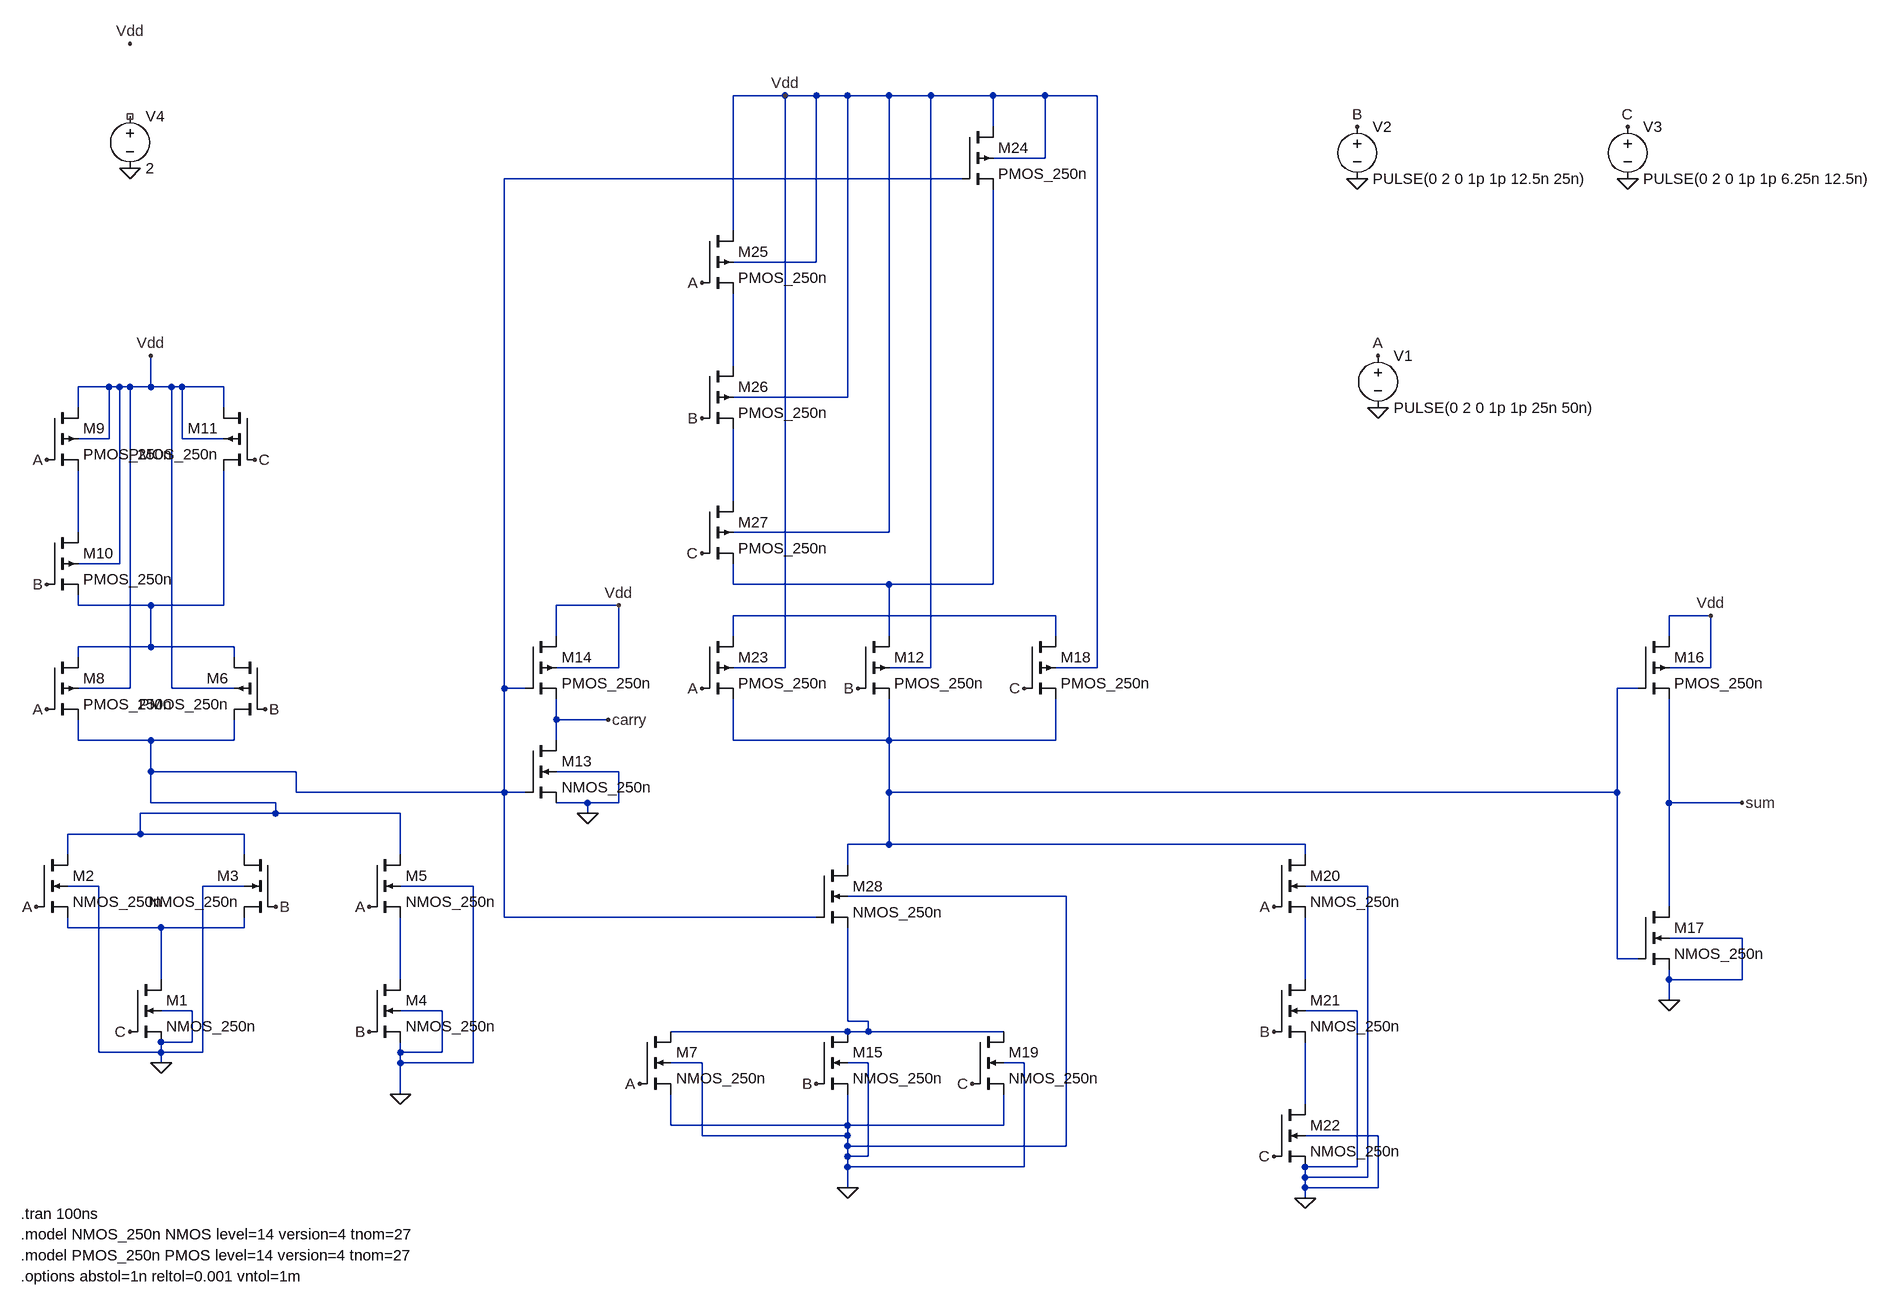
[diagram p0: schematic CMOS_Full_Adder.asc]
CMOS_Full_Adder.asc, the LTspice schematic file:
Version 4.1
SHEET 1 2684 760
WIRE 992 -1072 912 -1072
WIRE 1040 -1072 992 -1072
WIRE 1088 -1072 1040 -1072
WIRE 1152 -1072 1088 -1072
WIRE 1216 -1072 1152 -1072
WIRE 1312 -1072 1216 -1072
WIRE 1392 -1072 1312 -1072
WIRE 1472 -1072 1392 -1072
WIRE 1312 -1024 1312 -1072
WIRE 1392 -976 1392 -1072
WIRE 1392 -976 1312 -976
WIRE 1264 -944 560 -944
WIRE 912 -864 912 -1072
WIRE 1040 -816 1040 -1072
WIRE 1040 -816 912 -816
WIRE 912 -656 912 -768
WIRE -48 -624 -96 -624
WIRE -32 -624 -48 -624
WIRE -16 -624 -32 -624
WIRE 16 -624 16 -672
WIRE 16 -624 -16 -624
WIRE 48 -624 16 -624
WIRE 64 -624 48 -624
WIRE 128 -624 64 -624
WIRE 1088 -608 1088 -1072
WIRE 1088 -608 912 -608
WIRE -96 -592 -96 -624
WIRE 128 -592 128 -624
WIRE -48 -544 -48 -624
WIRE -48 -544 -96 -544
WIRE 64 -544 64 -624
WIRE 128 -544 64 -544
WIRE 912 -448 912 -560
WIRE -96 -400 -96 -496
WIRE 1152 -400 1152 -1072
WIRE 1152 -400 912 -400
WIRE -32 -352 -32 -624
WIRE -32 -352 -96 -352
WIRE 912 -320 912 -352
WIRE 1152 -320 912 -320
WIRE 1312 -320 1312 -928
WIRE 1312 -320 1152 -320
WIRE -96 -288 -96 -304
WIRE 16 -288 -96 -288
WIRE 128 -288 128 -496
WIRE 128 -288 16 -288
WIRE 736 -288 640 -288
WIRE 1408 -272 912 -272
WIRE 2416 -272 2352 -272
WIRE 640 -240 640 -288
WIRE 912 -240 912 -272
WIRE 1152 -240 1152 -320
WIRE 1408 -240 1408 -272
WIRE 2352 -240 2352 -272
WIRE 16 -224 16 -288
WIRE 16 -224 -96 -224
WIRE 144 -224 16 -224
WIRE -96 -208 -96 -224
WIRE 144 -208 144 -224
WIRE 736 -192 736 -288
WIRE 736 -192 640 -192
WIRE 992 -192 992 -1072
WIRE 992 -192 912 -192
WIRE 1216 -192 1216 -1072
WIRE 1216 -192 1152 -192
WIRE 1472 -192 1472 -1072
WIRE 1472 -192 1408 -192
WIRE 2416 -192 2416 -272
WIRE 2416 -192 2352 -192
WIRE -16 -160 -16 -624
WIRE -16 -160 -96 -160
WIRE 48 -160 48 -624
WIRE 144 -160 48 -160
WIRE 560 -160 560 -944
WIRE 592 -160 560 -160
WIRE 2304 -160 2272 -160
WIRE 640 -112 640 -144
WIRE 720 -112 640 -112
WIRE -96 -80 -96 -112
WIRE 16 -80 -96 -80
WIRE 144 -80 144 -112
WIRE 144 -80 16 -80
WIRE 640 -80 640 -112
WIRE 912 -80 912 -144
WIRE 1152 -80 1152 -144
WIRE 1152 -80 912 -80
WIRE 1408 -80 1408 -144
WIRE 1408 -80 1152 -80
WIRE 16 -32 16 -80
WIRE 240 -32 16 -32
WIRE 736 -32 640 -32
WIRE 240 0 240 -32
WIRE 560 0 560 -160
WIRE 560 0 240 0
WIRE 592 0 560 0
WIRE 1152 0 1152 -80
WIRE 2272 0 2272 -160
WIRE 2272 0 1152 0
WIRE 16 16 16 -32
WIRE 208 16 16 16
WIRE 688 16 640 16
WIRE 736 16 736 -32
WIRE 736 16 688 16
WIRE 2352 16 2352 -144
WIRE 2464 16 2352 16
WIRE 208 32 208 16
WIRE 208 32 0 32
WIRE 400 32 208 32
WIRE 688 32 688 16
WIRE 0 64 0 32
WIRE 0 64 -112 64
WIRE 160 64 0 64
WIRE 1152 80 1152 0
WIRE 1152 80 1088 80
WIRE 1792 80 1152 80
WIRE -112 96 -112 64
WIRE 160 96 160 64
WIRE 400 96 400 32
WIRE 1792 96 1792 80
WIRE 1088 112 1088 80
WIRE -64 144 -112 144
WIRE 160 144 96 144
WIRE 512 144 400 144
WIRE 1888 144 1792 144
WIRE 1424 160 1088 160
WIRE 2352 176 2352 16
WIRE 560 192 560 0
WIRE 1040 192 560 192
WIRE -112 208 -112 192
WIRE 32 208 -112 208
WIRE 160 208 160 192
WIRE 160 208 32 208
WIRE 2464 224 2352 224
WIRE 2272 256 2272 0
WIRE 2304 256 2272 256
WIRE 32 288 32 208
WIRE 400 288 400 192
WIRE 1792 288 1792 192
WIRE 2352 288 2352 272
WIRE 2464 288 2464 224
WIRE 2464 288 2352 288
WIRE 2352 320 2352 288
WIRE 80 336 32 336
WIRE 464 336 400 336
WIRE 1872 336 1792 336
WIRE 1088 352 1088 208
WIRE 1120 352 1088 352
WIRE 1088 368 816 368
WIRE 1120 368 1120 352
WIRE 1120 368 1088 368
WIRE 1328 368 1120 368
WIRE 80 384 80 336
WIRE 80 384 32 384
WIRE -64 400 -64 144
WIRE 32 400 32 384
WIRE 32 400 -64 400
WIRE 96 400 96 144
WIRE 96 400 32 400
WIRE 400 400 400 384
WIRE 464 400 464 336
WIRE 464 400 400 400
WIRE 32 416 32 400
WIRE 400 416 400 400
WIRE 512 416 512 144
WIRE 512 416 400 416
WIRE 864 416 816 416
WIRE 1120 416 1088 416
WIRE 1360 416 1328 416
WIRE 400 464 400 416
WIRE 1792 480 1792 384
WIRE 816 512 816 464
WIRE 1088 512 1088 464
WIRE 1088 512 816 512
WIRE 1328 512 1328 464
WIRE 1328 512 1088 512
WIRE 864 528 864 416
WIRE 1088 528 1088 512
WIRE 1088 528 864 528
WIRE 1904 528 1792 528
WIRE 1088 544 1088 528
WIRE 1424 544 1424 160
WIRE 1424 544 1088 544
WIRE 1088 560 1088 544
WIRE 1120 560 1120 416
WIRE 1120 560 1088 560
WIRE 1088 576 1088 560
WIRE 1360 576 1360 416
WIRE 1360 576 1088 576
WIRE 1872 576 1872 336
WIRE 1872 576 1792 576
WIRE 1792 592 1792 576
WIRE 1888 592 1888 144
WIRE 1888 592 1792 592
WIRE 1088 608 1088 576
WIRE 1792 608 1792 592
WIRE 1904 608 1904 528
WIRE 1904 608 1792 608
WIRE 1792 624 1792 608
FLAG -160 176 A
FLAG 352 368 B
FLAG 208 176 B
FLAG -16 368 C
FLAG 32 416 0
FLAG 400 464 0
FLAG 352 176 A
FLAG 768 448 A
FLAG -144 -512 A
FLAG -144 -128 A
FLAG -144 -320 B
FLAG 192 -128 B
FLAG 176 -512 C
FLAG 16 -672 Vdd
FLAG 1040 448 B
FLAG 1104 -160 B
FLAG 864 -576 B
FLAG 864 -784 A
FLAG 864 -160 A
FLAG 1280 448 C
FLAG 1360 -160 C
FLAG 864 -368 C
FLAG 1088 608 0
FLAG 688 32 0
FLAG 720 -112 carry
FLAG 736 -288 Vdd
FLAG 992 -1072 Vdd
FLAG 1744 176 A
FLAG 1744 368 B
FLAG 1744 560 C
FLAG 1792 624 0
FLAG 2352 320 0
FLAG 2416 -272 Vdd
FLAG 2464 16 sum
FLAG -16 -1152 Vdd
FLAG -16 -960 0
FLAG 1904 -672 A
FLAG 1872 -1024 B
FLAG 2288 -1024 C
FLAG 1872 -944 0
FLAG 1904 -592 0
FLAG 2288 -944 0
SYMBOL nmos4 -16 288 R0
SYMATTR InstName M1
SYMATTR Value NMOS_250n
SYMATTR Value2 l=250n w=1u
SYMBOL nmos4 -160 96 R0
SYMATTR InstName M2
SYMATTR Value NMOS_250n
SYMATTR Value2 l=250n w=1u
SYMBOL nmos4 208 96 M0
SYMATTR InstName M3
SYMATTR Value NMOS_250n
SYMATTR Value2 l=250n w=1u
SYMBOL nmos4 352 288 R0
SYMATTR InstName M4
SYMATTR Value NMOS_250n
SYMATTR Value2 l=250n w=1u
SYMBOL nmos4 352 96 R0
SYMATTR InstName M5
SYMATTR Value NMOS_250n
SYMATTR Value2 l=250n w=1u
SYMBOL pmos4 192 -208 M0
SYMATTR InstName M6
SYMATTR Value PMOS_250n
SYMATTR Value2 l=250n w=2u
SYMBOL nmos4 768 368 R0
SYMATTR InstName M7
SYMATTR Value NMOS_250n
SYMATTR Value2 l=250n w=1u
SYMBOL pmos4 -144 -208 R0
SYMATTR InstName M8
SYMATTR Value PMOS_250n
SYMATTR Value2 l=250n w=2u
SYMBOL pmos4 -144 -592 R0
SYMATTR InstName M9
SYMATTR Value PMOS_250n
SYMATTR Value2 l=250n w=2u
SYMBOL pmos4 -144 -400 R0
SYMATTR InstName M10
SYMATTR Value PMOS_250n
SYMATTR Value2 l=250n w=2u
SYMBOL pmos4 176 -592 M0
SYMATTR InstName M11
SYMATTR Value PMOS_250n
SYMATTR Value2 l=250n w=2u
SYMBOL pmos4 1104 -240 R0
SYMATTR InstName M12
SYMATTR Value PMOS_250n
SYMATTR Value2 l=250n w=2u
SYMBOL pmos4 592 -240 R0
SYMATTR InstName M14
SYMATTR Value PMOS_250n
SYMATTR Value2 l=250n w=2u
SYMBOL nmos4 592 -80 R0
SYMATTR InstName M13
SYMATTR Value NMOS_250n
SYMATTR Value2 l=250n w=1u
SYMBOL nmos4 1040 368 R0
SYMATTR InstName M15
SYMATTR Value NMOS_250n
SYMATTR Value2 l=250n w=1u
SYMBOL nmos4 1280 368 R0
SYMATTR InstName M19
SYMATTR Value NMOS_250n
SYMATTR Value2 l=250n w=1u
SYMBOL pmos4 864 -240 R0
SYMATTR InstName M23
SYMATTR Value PMOS_250n
SYMATTR Value2 l=250n w=2u
SYMBOL pmos4 864 -448 R0
SYMATTR InstName M27
SYMATTR Value PMOS_250n
SYMATTR Value2 l=250n w=2u
SYMBOL pmos4 864 -656 R0
SYMATTR InstName M26
SYMATTR Value PMOS_250n
SYMATTR Value2 l=250n w=2u
SYMBOL pmos4 864 -864 R0
SYMATTR InstName M25
SYMATTR Value PMOS_250n
SYMATTR Value2 l=250n w=2u
SYMBOL pmos4 1264 -1024 R0
SYMATTR InstName M24
SYMATTR Value PMOS_250n
SYMATTR Value2 l=250n w=2u
SYMBOL pmos4 1360 -240 R0
SYMATTR InstName M18
SYMATTR Value PMOS_250n
SYMATTR Value2 l=250n w=2u
SYMBOL nmos4 1040 112 R0
SYMATTR InstName M28
SYMATTR Value NMOS_250n
SYMATTR Value2 l=250n w=1u
SYMBOL nmos4 1744 96 R0
SYMATTR InstName M20
SYMATTR Value NMOS_250n
SYMATTR Value2 l=250n w=1u
SYMBOL nmos4 1744 288 R0
SYMATTR InstName M21
SYMATTR Value NMOS_250n
SYMATTR Value2 l=250n w=1u
SYMBOL nmos4 1744 480 R0
SYMATTR InstName M22
SYMATTR Value NMOS_250n
SYMATTR Value2 l=250n w=1u
SYMBOL nmos4 2304 176 R0
SYMATTR InstName M17
SYMATTR Value NMOS_250n
SYMATTR Value2 l=250n w=1u
SYMBOL pmos4 2304 -240 R0
SYMATTR InstName M16
SYMATTR Value PMOS_250n
SYMATTR Value2 l=250n w=2u
SYMBOL voltage -16 -1056 R0
WINDOW 123 0 0 Left 0
WINDOW 39 0 0 Left 0
SYMATTR InstName V4
SYMATTR Value 2
SYMBOL voltage 1904 -688 R0
WINDOW 123 0 0 Left 0
WINDOW 39 0 0 Left 0
SYMATTR InstName V1
SYMATTR Value PULSE(0 2 0 1p 1p 25n 50n)
SYMBOL voltage 1872 -1040 R0
SYMATTR InstName V2
SYMATTR Value PULSE(0 2 0 1p 1p 12.5n 25n)
SYMBOL voltage 2288 -1040 R0
SYMATTR InstName V3
SYMATTR Value PULSE(0 2 0 1p 1p 6.25n 12.5n)
TEXT -184 648 Left 2 !.tran 100ns
TEXT -184 680 Left 2 !.model NMOS_250n NMOS level=14 version=4 tnom=27
TEXT -184 712 Left 2 !.model PMOS_250n PMOS level=14 version=4 tnom=27
TEXT -184 744 Left 2 !.options abstol=1n reltol=0.001 vntol=1m

The netlist it stands for:
* CMOS_Full_Adder.asc
M1 N009 C 0 0 NMOS_250n l=250n w=1u
M2 N001 A N009 0 NMOS_250n l=250n w=1u
M3 N001 B N009 0 NMOS_250n l=250n w=1u
M4 N010 B 0 0 NMOS_250n l=250n w=1u
M5 N001 A N010 0 NMOS_250n l=250n w=1u
M6 N006 B N001 Vdd PMOS_250n l=250n w=2u
M7 N012 A 0 0 NMOS_250n l=250n w=1u
M8 N006 A N001 Vdd PMOS_250n l=250n w=2u
M9 Vdd A N004 Vdd PMOS_250n l=250n w=2u
M10 N004 B N006 Vdd PMOS_250n l=250n w=2u
M11 Vdd C N006 Vdd PMOS_250n l=250n w=2u
M12 N005 B N008 Vdd PMOS_250n l=250n w=2u
M14 Vdd N001 carry Vdd PMOS_250n l=250n w=2u
M13 carry N001 0 0 NMOS_250n l=250n w=1u
M15 N012 B 0 0 NMOS_250n l=250n w=1u
M19 N012 C 0 0 NMOS_250n l=250n w=1u
M23 N007 A N008 Vdd PMOS_250n l=250n w=2u
M27 N003 C N005 Vdd PMOS_250n l=250n w=2u
M26 N002 B N003 Vdd PMOS_250n l=250n w=2u
M25 Vdd A N002 Vdd PMOS_250n l=250n w=2u
M24 Vdd N001 N005 Vdd PMOS_250n l=250n w=2u
M18 N007 C N008 Vdd PMOS_250n l=250n w=2u
M28 N008 N001 N012 0 NMOS_250n l=250n w=1u
M20 N008 A N011 0 NMOS_250n l=250n w=1u
M21 N011 B N013 0 NMOS_250n l=250n w=1u
M22 N013 C 0 0 NMOS_250n l=250n w=1u
M17 sum N008 0 0 NMOS_250n l=250n w=1u
M16 Vdd N008 sum Vdd PMOS_250n l=250n w=2u
V4 NC_01 0 2
V1 A 0 PULSE(0 2 0 1p 1p 25n 50n)
V2 B 0 PULSE(0 2 0 1p 1p 12.5n 25n)
V3 C 0 PULSE(0 2 0 1p 1p 6.25n 12.5n)
.model NMOS NMOS
.model PMOS PMOS
.lib standard.mos
.tran 100ns
.model NMOS_250n NMOS level=14 version=4 tnom=27
.model PMOS_250n PMOS level=14 version=4 tnom=27
.options abstol=1n reltol=0.001 vntol=1m
.backanno
.end